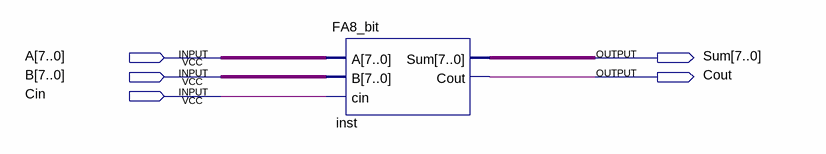
[diagram p0: schematic sheet]
// Quartus schematic FA8_bit1.bdf as structural Verilog: 1 symbols, 5 pins
module FA8_bit1 (
  input  [7:0] A,
  input  [7:0] B,
  input  Cin,
  output [7:0] Sum,
  output Cout
);

  FA8_bit inst (.A(A), .B(B), .cin(Cin), .Sum(Sum), .Cout(Cout));
endmodule
